# EAGLE design modulator-switch (EAGLE 8.3.1)
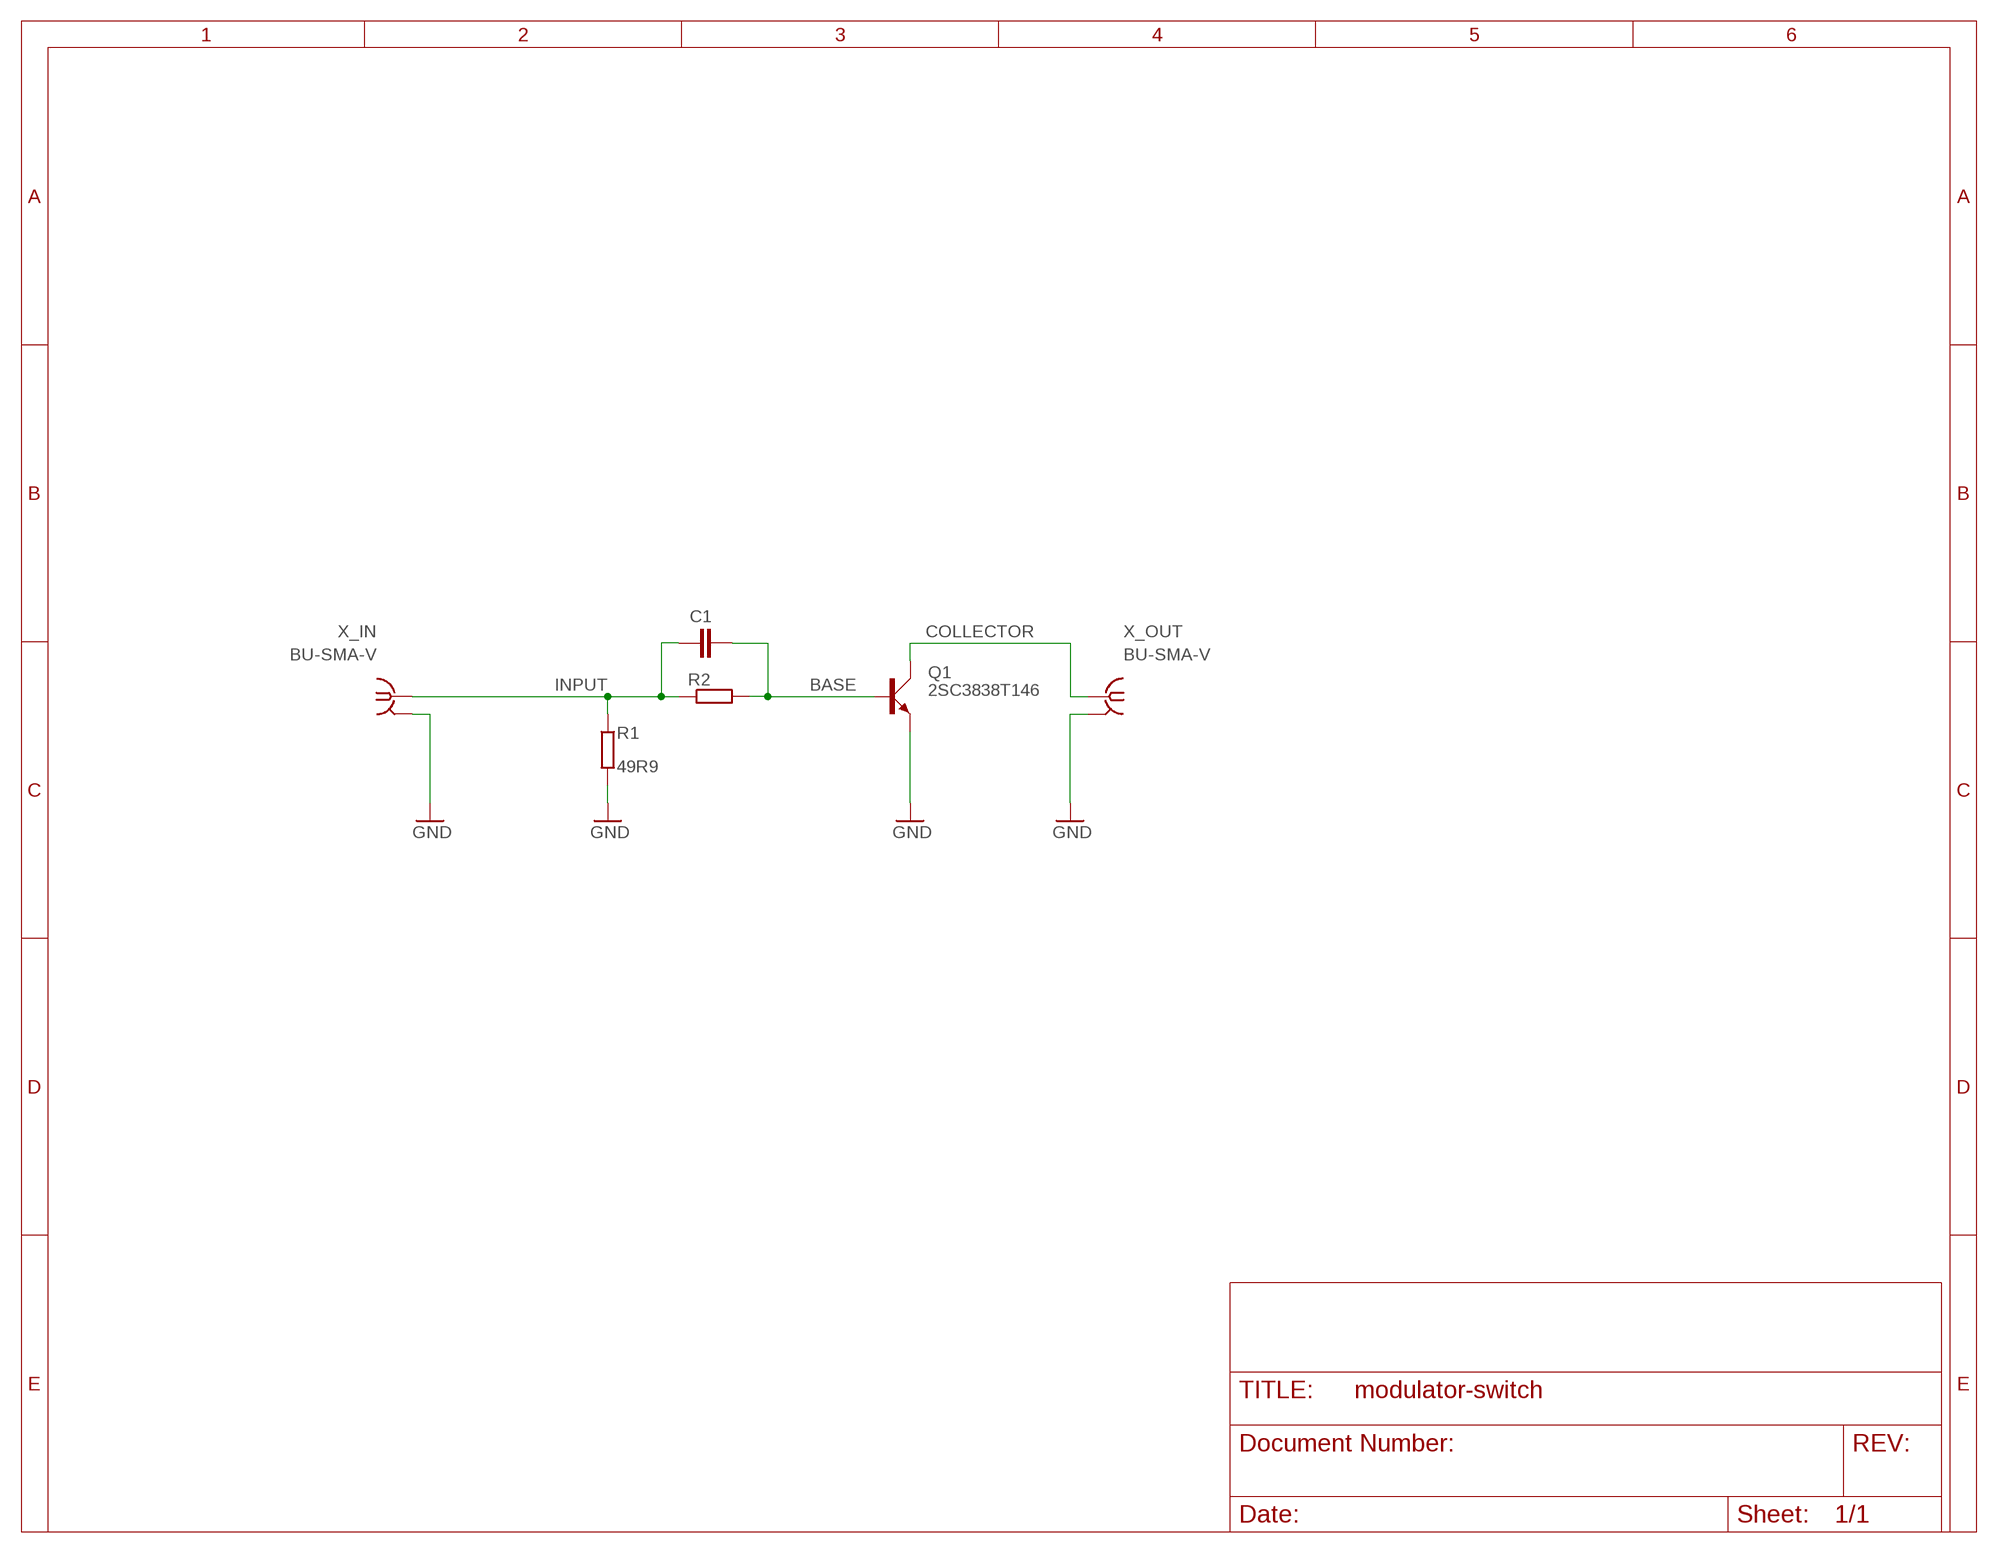
[diagram p0: schematic, sheet 1]

## Parts
C1  C-EUC0603  [C0603]
Q1  2SC3838T146  [SC59]
R1  49R9  R-EU_R0805  [R0805]
R2  R-EU_R0603  [R0603]
X_IN  BU-SMA-V  [BU-SMA-V]
X_OUT  BU-SMA-V  [BU-SMA-V]

## Nets
BASE: C1.2 Q1.B R2.2
COLLECTOR: Q1.C X_OUT.1
GND: Q1.E R1.2 X_IN.2(GND) X_OUT.2(GND)
INPUT: C1.1 R1.1 R2.1 X_IN.1

## Power pins joined to a net without a drawn wire
GND: X_IN.3(GND) X_IN.4(GND) X_IN.5(GND) X_OUT.3(GND) X_OUT.4(GND) X_OUT.5(GND)

## Library data of the parts
C1 = rcl:C-EU: CAPACITOR, European symbol
Q1 = transistor-small-signal:2SC3838: High-Frequency Amplifier Transistor 11V, 50mA, 3.2GHz (Rohm)
R1 R2 = rcl:R-EU_: RESISTOR, European symbol
X_IN X_OUT = con-coax:BU-SMA-V: FEMALE SMA CONNECTOR Radiall distributor RS 112-3794; OC_FARNELL: unknown; OC_NEWARK: unknown

## Board
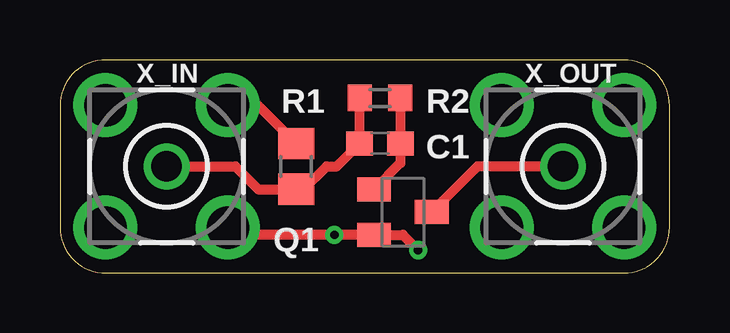
[diagram p1: board, top side]
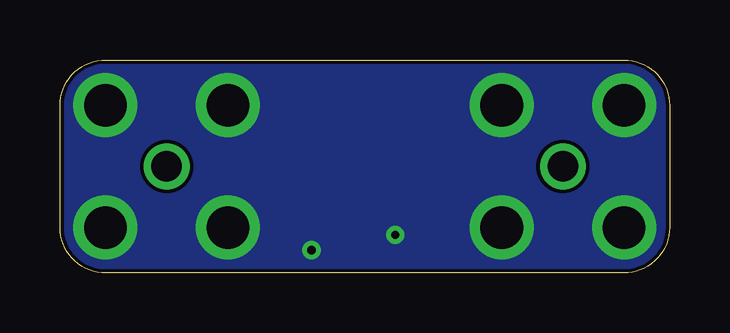
[diagram p2: board, bottom side, seen from below]

Size 25.4 x 8.89 mm. Coordinates in mm from the lower left corner, seen from the top.
Outline: 0,6.99 0,1.91 arc90 1.91,0 23.5,0 arc90 25.4,1.91 25.4,6.99 arc90 23.5,8.89 1.91,8.89 arc90 0,6.99
Copper layers (1*16): Top 0.035mm / dielectric 1.5mm / Bottom 0.035mm
Design rules "default *": minimum track width 6mil, minimum drill 0.35mm, track to track 6mil, track to pad 6mil, pad to pad 6mil, via to via 6mil, smd to smd 6mil, copper to edge 6mil, drill to drill 6mil, minimum pad ring 10mil, minimum via ring 8mil, stop-mask expansion 4mil, vias tented up to drill 0mil, thermal gap 10mil

### Footprints (pad centres in the part's own frame; a part is rotated, then mirrored left to right if it is on the bottom)
C0603 = smd 1.1 x 1: 1 -0.85,0; 2 0.85,0
SC59 = smd 1 x 1.4: B -0.95,-1.2; C 0,1.2; E 0.95,-1.2
R0805 = smd 1.3 x 1.5: 1 -0.95,0; 2 0.95,0
R0603 = smd 1 x 1.1: 1 -0.85,0; 2 0.85,0
BU-SMA-V = drill 1.27: 1 0,0 | drill 1.778: 2 -2.55,2.55; 3 2.55,2.55; 4 2.55,-2.55; 5 -2.55,-2.55

### Placement (x,y rotation side)
C1  13.34,5.4 0 top
Q1  14.29,2.54 270 top
R1  9.84,4.45 90 top
R2  13.34,7.3 0 top
X_IN  4.45,4.45 0 top
X_OUT  20.95,4.45 0 top

### Tracks (layer width: path | path; a pad name or v marks a point on that pad's centre or on a via)
BASE
  Top 0.406: R2.2 C1.2 14.19,4.59 Q1.B
COLLECTOR
  Top 0.406: X_OUT.1 17.39,4.45 Q1.C
GND  (via drill 0.35)
  Top 0.406: X_IN.3 8.24,7 R1.2 | v14.92,0.95 14.29,1.59 Q1.E v11.43,1.59 7.3,1.59 X_IN.4
  pour Bottom: 0,9.21 25.72,9.21 25.72,0 0,0
  pour Bottom (no thermals): 0,8.89 25.4,8.89 25.4,0 0,0
INPUT
  Top 0.406: X_IN.1 7.3,4.45 8.26,3.49 R1.1 10.16,3.5 11.11,4.45 11.53,4.45 C1.1 R2.1